# Altium schematic sheet [5]Flash_SDCard.SchDoc
size A4
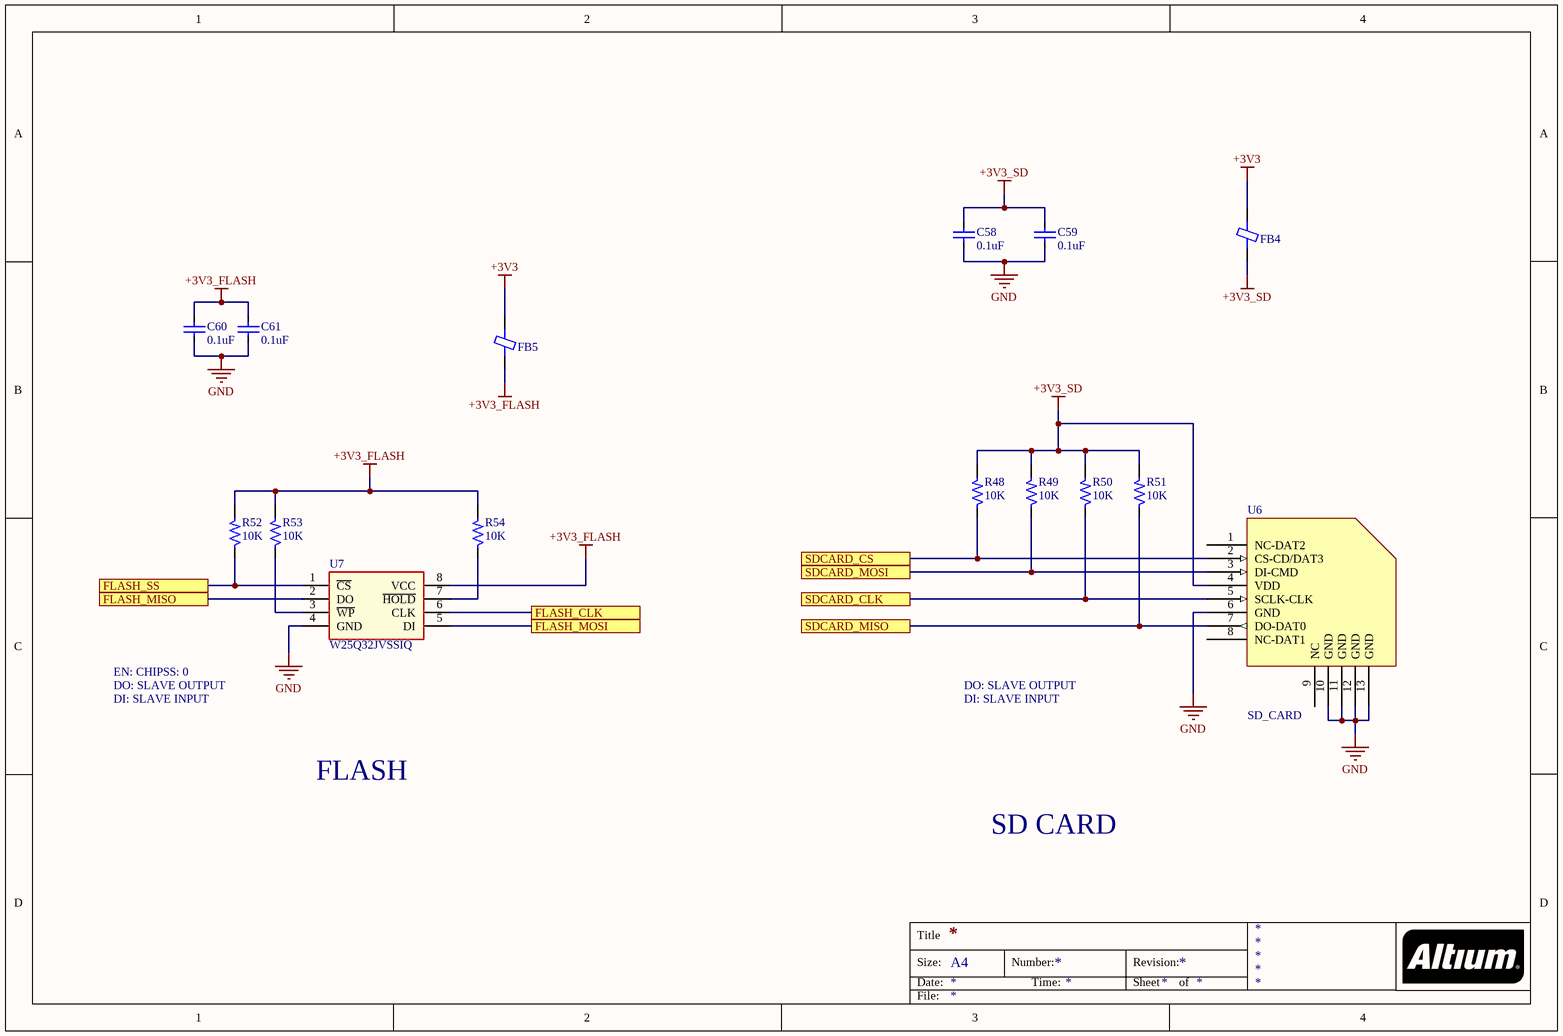
[diagram p0: [5]Flash_SDCard.SchDoc]

## Parts
C58  0.1uF  [CAP_0805]
C59  0.1uF  [CAP_0805]
C60  0.1uF  [CAP_0805]
C61  0.1uF  [CAP_0805]
FB4  120R  [RES-SMD-0805]  (value not drawn)
FB5  120R  [RES-SMD-0805]  (value not drawn)
R48  10K  [R0805]
R49  10K  [R0805]
R50  10K  [R0805]
R51  10K  [R0805]
R52  10K  [R0805]
R53  10K  [R0805]
R54  10K  [R0805]
U6  SD_CARD  [MICROSD2]
U7  W25Q32JVSSIQ  [SO-8 208]

## Ports
FLASH_CLK, FLASH_MISO, FLASH_MOSI, FLASH_SS, SDCARD_CLK, SDCARD_CS, SDCARD_MISO, SDCARD_MOSI

## Nets
+3V3: FB4.1 FB5.1
+3V3_FLASH: C60.2 C61.2 FB5.2 R52.2 R53.2 R54.2 U7.8(VCC)
+3V3_SD: C58.2 C59.2 FB4.2 R48.2 R49.2 R50.2 R51.2 U6.4(VDD)
GND: C58.1 C59.1 C60.1 C61.1 U6.6(GND) U6.10(GND) U6.11(GND) U6.12(GND) U6.13(GND) U7.4(GND)
FLASH_CLK: U7.6(CLK) ; port FLASH_CLK
FLASH_MISO: U7.2(DO) ; port FLASH_MISO
FLASH_MOSI: U7.5(DI) ; port FLASH_MOSI
FLASH_SS: R52.1 U7.1(~{CS}) ; port FLASH_SS
SDCARD_CLK: R50.1 U6.5(SCLK-CLK) ; port SDCARD_CLK
SDCARD_CS: R48.1 U6.2(CS-CD/DAT3) ; port SDCARD_CS
SDCARD_MISO: R51.1 U6.7(DO-DAT0) ; port SDCARD_MISO
SDCARD_MOSI: R49.1 U6.3(DI-CMD) ; port SDCARD_MOSI
NetR53_1: R53.1 U7.3(~{WP})
NetR54_1: R54.1 U7.7(~{HOLD})

Not connected (* = marked no-connect by the designer): U6 1(NC-DAT2) 8(NC-DAT1) 9(NC)

## Notes on the sheet
- EN: CHIPSS: 0
- DO: SLAVE OUTPUT
- DI: SLAVE INPUT
- FLASH
- SD CARD
- Title
- Size:
- Date:
- A4
- Number:
- Time:
- Revision:
- Sheet
- of
- File:

## Library data of the parts
C58-C61 = CapSMD: Capacitor; Value: 33p; Published: 8-Jun-2000; LatestRevisionDate: 17-Jul-2002; LatestRevisionNote: Re-released for DXP Platform.; PackageReference: RAD-0.3; Publisher: Altium Limited
FB4 FB5 = Ferrite beads
R48-R54 = RM: Resistor SMD; Value: 1K
U6 = MicroSD: SD/MMC holder
U7 = W25Q32JV: FLASH 32MBIT 133MHZ 8SOP